# EAGLE design testboard (EAGLE 7.2.0)
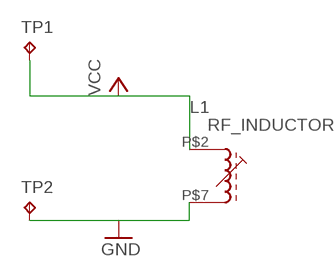
[diagram p0: schematic, sheet 1]

## Parts
L1  RF_INDUCTOR  [ADJ_IND_NON_STD_PKG]
TP1  TPB2,54  [B2,54]
TP2  TPB2,54  [B2,54]

## Nets
GND: L1.P$7(E1) TP2.TP
VCC: L1.P$2(A1) TP1.TP

## Library data of the parts
L1 = E3VB_ISI:RF_INDUCTOR
TP1 TP2 = testpad:TP: Test pad

## Board
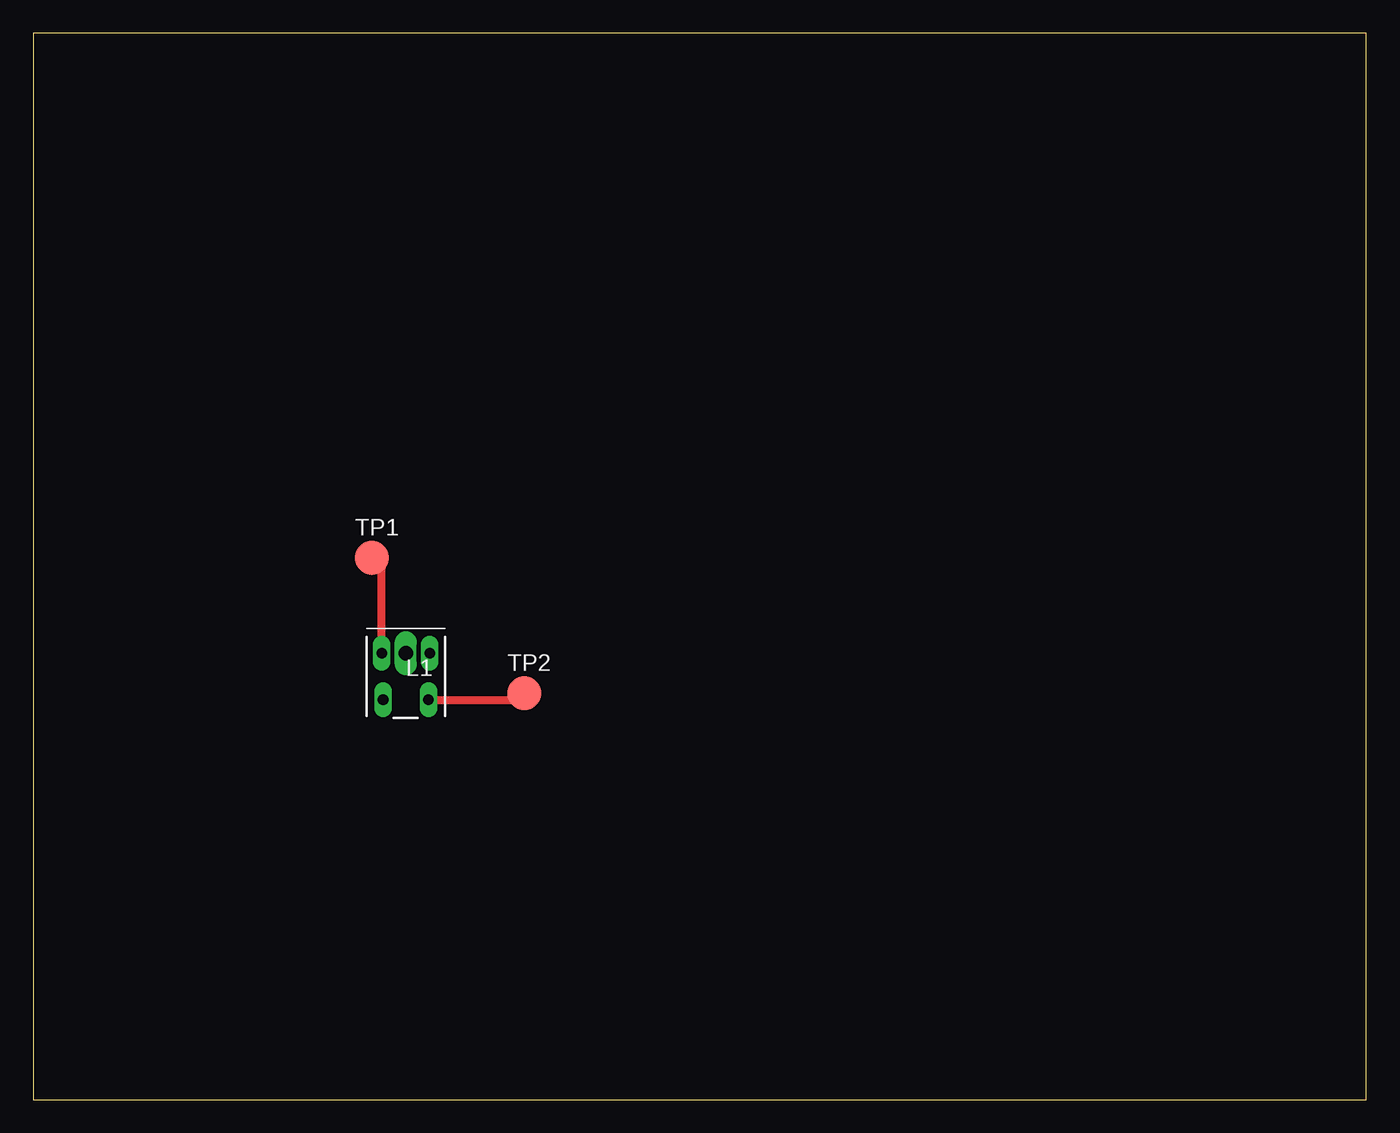
[diagram p1: board, top side]

Size 100 x 80 mm. Coordinates in mm from the lower left corner, seen from the top.
Outline: 0,0 100,0 100,80 0,80 0,0
Copper layers (1*16): Top 0.035mm / dielectric 1.5mm / Bottom 0.035mm
Design rules "default": minimum track width 10mil, minimum drill 24mil, track to track 8mil, track to pad 8mil, pad to pad 8mil, via to via 8mil, smd to smd 8mil, copper to edge 40mil, drill to drill 8mil, minimum pad ring 10mil, minimum via ring 8mil, stop-mask expansion 4mil, vias tented up to drill 0mil, thermal gap 10mil

### Footprints (pad centres in the part's own frame; a part is rotated, then mirrored left to right if it is on the bottom)
ADJ_IND_NON_STD_PKG = drill 0.8 long: P$2 -1.8,1.75; P$4 1.8,1.75; P$6 -1.7,-1.75; P$7 1.7,-1.75 | drill 1.1 long: P$3 0,1.75
B2,54 = smd 2.54 x 2.54: TP 0,0

### Placement (x,y rotation side)
L1  27.94,31.75 0 top
TP1  25.4,40.64 0 top
TP2  36.83,30.48 0 top

### Tracks (layer width: path | path; a pad name or v marks a point on that pad's centre or on a via)
GND
  Top 0.61: L1.P$7 36.83,30 TP2.TP
VCC
  Top 0.61: L1.P$2 26.14,39.9 TP1.TP